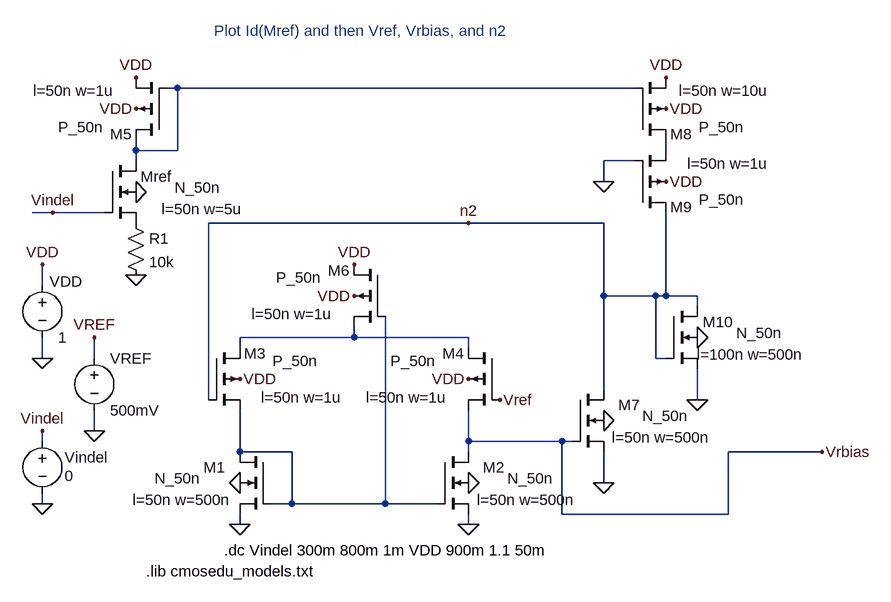
[diagram p0: schematic Fig19_59.asc]
Fig19_59.asc, the LTspice schematic file:
Version 4
SHEET 1 1564 680
WIRE 272 -640 272 -672
WIRE 272 -528 272 -560
WIRE 272 -400 272 -416
WIRE 272 -304 272 -320
WIRE 288 -752 256 -752
WIRE 352 -528 352 -560
WIRE 352 -416 352 -448
WIRE 368 -752 288 -752
WIRE 416 -848 416 -864
WIRE 416 -832 416 -848
WIRE 480 -944 464 -944
WIRE 480 -848 416 -848
WIRE 480 -848 480 -944
WIRE 528 -464 528 -736
WIRE 576 -544 576 -560
WIRE 576 -384 576 -448
WIRE 576 -272 576 -288
WIRE 656 -384 576 -384
WIRE 656 -304 624 -304
WIRE 656 -304 656 -384
WIRE 752 -560 576 -560
WIRE 752 -560 752 -576
WIRE 800 -304 656 -304
WIRE 800 -304 800 -592
WIRE 880 -304 800 -304
WIRE 928 -736 528 -736
WIRE 928 -560 752 -560
WIRE 928 -544 928 -560
WIRE 928 -400 928 -448
WIRE 928 -384 928 -400
WIRE 928 -272 928 -288
WIRE 1072 -400 928 -400
WIRE 1072 -288 1072 -400
WIRE 1088 -400 1072 -400
WIRE 1136 -800 1136 -832
WIRE 1136 -736 928 -736
WIRE 1136 -624 1136 -736
WIRE 1136 -480 1136 -624
WIRE 1136 -336 1136 -384
WIRE 1184 -944 480 -944
WIRE 1184 -832 1136 -832
WIRE 1216 -624 1136 -624
WIRE 1216 -528 1216 -624
WIRE 1232 -848 1232 -864
WIRE 1232 -624 1216 -624
WIRE 1232 -624 1232 -752
WIRE 1232 -528 1216 -528
WIRE 1280 -624 1232 -624
WIRE 1280 -608 1280 -624
WIRE 1280 -464 1280 -512
WIRE 1328 -288 1072 -288
WIRE 1328 -288 1328 -384
WIRE 1472 -384 1328 -384
FLAG 272 -304 0
FLAG 272 -416 Vindel
FLAG 576 -336 0
FLAG 272 -528 0
FLAG 272 -672 VDD
FLAG 576 -496 VDD
FLAG 928 -496 VDD
FLAG 928 -336 0
FLAG 416 -912 VDD
FLAG 1136 -432 0
FLAG 1136 -336 0
FLAG 752 -624 VDD
FLAG 752 -672 VDD
FLAG 576 -272 0
FLAG 928 -272 0
FLAG 416 -960 VDD
FLAG 416 -784 0
FLAG 416 -656 0
FLAG 288 -752 Vindel
FLAG 352 -416 0
FLAG 352 -560 VREF
FLAG 1232 -912 VDD
FLAG 1232 -960 VDD
FLAG 1232 -800 VDD
FLAG 1136 -800 0
FLAG 1280 -560 0
FLAG 1280 -464 0
FLAG 976 -464 Vref
FLAG 1472 -384 Vrbias
FLAG 928 -736 n2
SYMBOL nmos4 624 -384 M0
WINDOW 0 104 24 Right 0
WINDOW 3 179 41 Right 0
WINDOW 123 213 74 Right 0
SYMATTR InstName M1
SYMATTR Value N_50n
SYMATTR Value2 l=50n w=500n
SYMBOL voltage 272 -416 R0
WINDOW 0 34 41 Left 0
WINDOW 3 34 69 Left 0
WINDOW 123 0 0 Left 0
WINDOW 39 0 0 Left 0
SYMATTR InstName Vindel
SYMATTR Value 0
SYMBOL voltage 272 -656 R0
WINDOW 123 0 0 Left 0
WINDOW 39 0 0 Left 0
WINDOW 0 11 10 Left 0
SYMATTR InstName VDD
SYMATTR Value 1
SYMBOL pmos4 528 -544 R0
WINDOW 0 88 9 Right 0
WINDOW 3 168 20 Right 0
WINDOW 123 206 76 Right 0
SYMATTR InstName M3
SYMATTR Value P_50n
SYMATTR Value2 l=50n w=1u
SYMBOL pmos4 976 -544 M0
WINDOW 0 88 9 Right 0
WINDOW 3 168 20 Right 0
WINDOW 123 206 76 Right 0
SYMATTR InstName M4
SYMATTR Value P_50n
SYMATTR Value2 l=50n w=1u
SYMBOL nmos4 880 -384 R0
WINDOW 0 104 24 Right 0
WINDOW 3 179 41 Right 0
WINDOW 123 213 74 Right 0
SYMATTR InstName M2
SYMATTR Value N_50n
SYMATTR Value2 l=50n w=500n
SYMBOL pmos4 464 -864 R180
WINDOW 0 88 9 Right 0
WINDOW 3 168 20 Right 0
WINDOW 123 206 76 Right 0
SYMATTR InstName M5
SYMATTR Value P_50n
SYMATTR Value2 l=50n w=1u
SYMBOL nmos4 1088 -480 R0
WINDOW 0 104 24 Right 0
WINDOW 3 179 41 Right 0
WINDOW 123 213 74 Right 0
SYMATTR InstName M7
SYMATTR Value N_50n
SYMATTR Value2 l=50n w=500n
SYMBOL pmos4 800 -672 M0
WINDOW 0 88 9 Right 0
WINDOW 3 168 20 Right 0
WINDOW 123 206 76 Right 0
SYMATTR InstName M6
SYMATTR Value P_50n
SYMATTR Value2 l=50n w=1u
SYMBOL nmos4 368 -832 R0
WINDOW 0 104 24 Right 0
WINDOW 3 179 41 Right 0
WINDOW 123 213 74 Right 0
SYMATTR InstName Mref
SYMATTR Value N_50n
SYMATTR Value2 l=50n w=5u
SYMBOL res 400 -752 R0
SYMATTR InstName R1
SYMATTR Value 10k
SYMBOL voltage 352 -544 R0
WINDOW 123 0 0 Left 0
WINDOW 39 0 0 Left 0
SYMATTR InstName VREF
SYMATTR Value 500mV
SYMBOL pmos4 1184 -864 M180
WINDOW 0 88 9 Right 0
WINDOW 3 168 20 Right 0
WINDOW 123 206 76 Right 0
SYMATTR InstName M8
SYMATTR Value P_50n
SYMATTR Value2 l=50n w=10u
SYMBOL pmos4 1184 -752 M180
WINDOW 0 88 9 Right 0
WINDOW 3 168 20 Right 0
WINDOW 123 206 76 Right 0
SYMATTR InstName M9
SYMATTR Value P_50n
SYMATTR Value2 l=50n w=1u
SYMBOL nmos4 1232 -608 R0
WINDOW 0 104 24 Right 0
WINDOW 3 179 41 Right 0
WINDOW 123 213 74 Right 0
SYMATTR InstName M10
SYMATTR Value N_50n
SYMATTR Value2 l=100n w=500n
TEXT 552 -232 Left 0 !.dc Vindel 300m 800m 1m VDD 900m 1.1 50m
TEXT 432 -200 Left 0 !.lib cmosedu_models.txt
TEXT 536 -1032 Left 0 ;Plot Id(Mref) and then Vref, Vrbias, and n2

The netlist it stands for:
* Fig19_59.asc
M1 N003 N003 0 0 N_50n l=50n w=500n
Vindel Vindel 0 0
VDD VDD 0 1
M3 N002 n2 N003 VDD P_50n l=50n w=1u
M4 N002 VREF Vrbias VDD P_50n l=50n w=1u
M2 Vrbias N003 0 0 N_50n l=50n w=500n
M5 N001 N001 VDD VDD P_50n l=50n w=1u
M7 n2 Vrbias 0 0 N_50n l=50n w=500n
M6 VDD N003 N002 VDD P_50n l=50n w=1u
Mref N001 Vindel P001 0 N_50n l=50n w=5u
R1 P001 0 10k
VREF VREF 0 500mV
M8 N004 N001 VDD VDD P_50n l=50n w=10u
M9 n2 0 N004 VDD P_50n l=50n w=1u
M10 n2 n2 0 0 N_50n l=100n w=500n
.model NMOS NMOS
.model PMOS PMOS
.lib standard.mos
.dc Vindel 300m 800m 1m VDD 900m 1.1 50m
.lib cmosedu_models.txt
* Plot Id(Mref) and then Vref, Vrbias, and n2
.backanno
.end